# EAGLE schematic ADC (EAGLE 7.2.0)
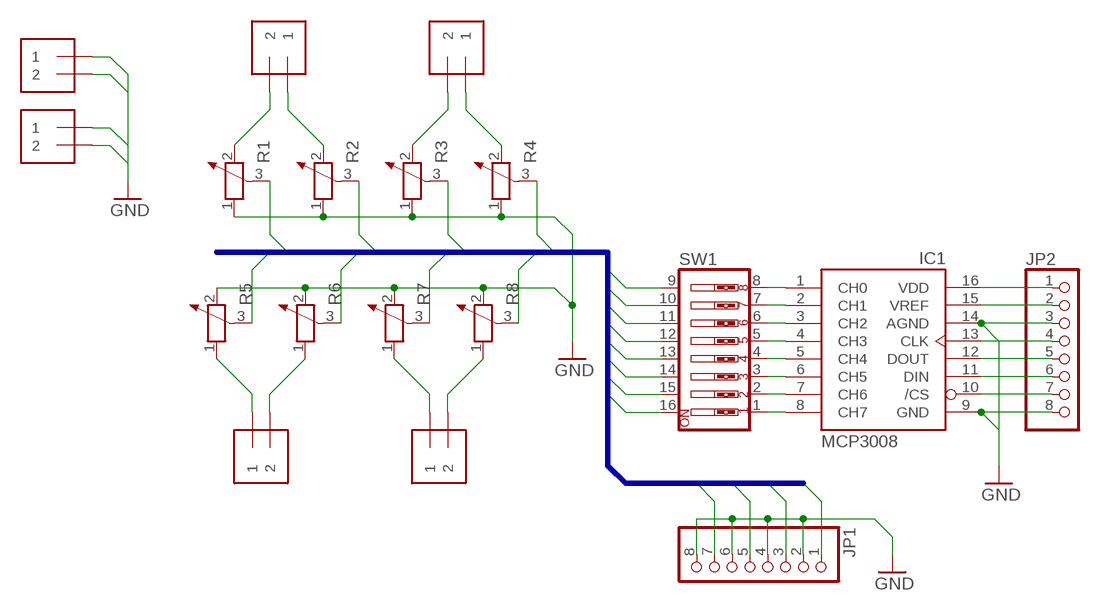
[diagram p0: schematic, sheet 1]

## Parts
IC1  MCP3008  [DIL16]
J1  1X2-3.5MM  [1X2-3.5MM]
J2  1X2-3.5MM  [1X2-3.5MM]
J3  1X2-3.5MM  [1X2-3.5MM]
J4  1X2-3.5MM  [1X2-3.5MM]
J5  1X2-3.5MM  [1X2-3.5MM]
J6  1X2-3.5MM  [1X2-3.5MM]
JP1  PINHD-1X8CLEANBIG  [1X08-CLEANBIG]
JP2  PINHD-1X8CLEANBIG  [1X08-CLEANBIG]
R1  POTENTIOMETER_PT-10  [PT-10]
R2  POTENTIOMETER_PT-10  [PT-10]
R3  POTENTIOMETER_PT-10  [PT-10]
R4  POTENTIOMETER_PT-10  [PT-10]
R5  POTENTIOMETER_PT-10  [PT-10]
R6  POTENTIOMETER_PT-10  [PT-10]
R7  POTENTIOMETER_PT-10  [PT-10]
R8  POTENTIOMETER_PT-10  [PT-10]
SW1  SW_DIP-8  [EDG-08]

## Nets
B$1: JP1.1 JP1.3 JP1.5 JP1.7 R1.3 R2.3 R3.3 R4.3 R5.3 R6.3 R7.3 R8.3 SW1.9 SW1.10 SW1.11 SW1.12 SW1.13 SW1.14 SW1.15 SW1.16
GND: IC1.9(GND) IC1.14(AGND) J5.1 J5.2 J6.1 J6.2 JP1.2 JP1.4 JP1.6 JP1.8 JP2.3 JP2.8 R1.1 R2.1 R3.1 R4.1 R5.2 R6.2 R7.2 R8.2
N$1: J2.2 R1.2
N$2: J2.1 R2.2
N$3: J1.2 R3.2
N$4: J1.1 R4.2
N$5: J3.1 R5.1
N$6: J3.2 R6.1
N$7: J4.1 R7.1
N$8: J4.2 R8.1
N$10: IC1.1(CH0) SW1.8
N$11: IC1.2(CH1) SW1.7
N$12: IC1.3(CH2) SW1.6
N$13: IC1.4(CH3) SW1.5
N$14: IC1.5(CH4) SW1.4
N$15: IC1.6(CH5) SW1.3
N$16: IC1.7(CH6) SW1.2
N$17: IC1.8(CH7) SW1.1
N$18: IC1.16(VDD) JP2.1
N$19: IC1.15(VREF) JP2.2
N$21: IC1.13(CLK) JP2.4
N$22: IC1.12(DOUT) JP2.5
N$23: IC1.11(DIN) JP2.6
N$24: IC1.10(/CS) JP2.7

## Buses
B$1

## Library data of the parts
IC1 = adafruit:MCP3008
J1-J6 = adafruit:1X2: 3.5mm Terminal block http://www.ladyada.net/library/pcb/eaglelibrary.html
JP1 JP2 = adafruit:PINHD-1X8: PIN HEADER
R1-R8 = rcl:POTENTIOMETER_: Potentiometer
SW1 = special:SW_DIP-8: DIP SWITCH